# Altium schematic sheet EEPROM.SchDoc: EEPROM
size A4; ApprovedBy: LD Stanton; Author: LD Stanton; CompanyName: University of Cape Town; DrawnBy: Lawrence Stanton; Engineer: Lawrence Stanton; Organization: University of Cape Town; Address1: Department of Electrical Engineering; Address2: Rondebosch; Address3: Cape Town; Address4: South Africa 7701; DocumentNumber: 12; SheetNumber: 12; SheetTotal: 20
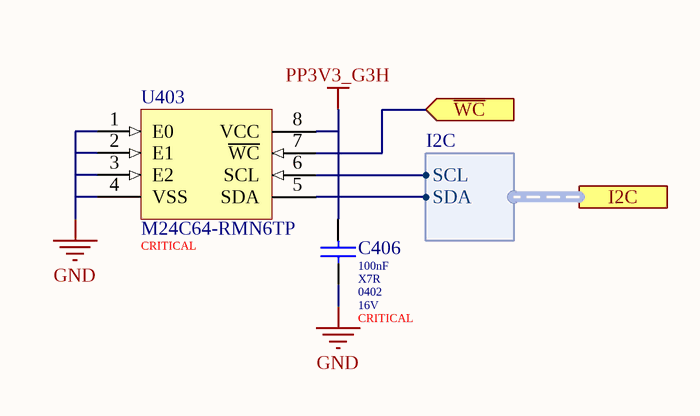
[diagram p0: EEPROM.SchDoc]

## Parts
C406  value 100nF  Dielectric: X7R  Package: 0402  Voltage: 16V  Populate: CRITICAL  [0402_050_5 (Samsumg) B]  (hidden comment: CL05B104KO5NNNC)
U403  M24C64-RMN6TP  Placement: CRITICAL  [SO8N (M24) B]

## Ports
I2C (harness I2C), ~{WC} (in)

## Harnesses
I2C: SCL, SDA

## Nets
GND: C406.2 U403.1(E0) U403.2(E1) U403.3(E2) U403.4(VSS)
PP3V3_G3H: C406.1 U403.8(VCC)
~{WC}: U403.7(~{WC}) ; port ~{WC}
NetU403_5: U403.5(SDA) ; port I2C.SDA
NetU403_6: U403.6(SCL) ; port I2C.SCL

## Notes on the sheet
- Size:
- Date:
- A4
- Number:
- Time:
- Revision:
- Sheet
- of
- File:
- Author:

## Library data of the parts
C406 = CMP-045-000014-12: MLCC 100nF 0402 16V X7R ±10%; Manufacturer: Samsung; ComponentLink1Description: Datasheet; ComponentLink1URL: https://datasheet.lcsc.com/szlcsc/Samsung-Electro-Mechanics-CL05C100JB5NNNC_C32949.pdf; LCSC Part Number: C1525; Tolerance: ±10%
U403 = CMP-001-0001-4: IC EEPROM 64KBIT 1MHZ 8TSSOP; Manufacturer: STMicroelectronics; Manufacturer Part Number: M24512-RDW6TP; Ibis Model: M24C32; Nominal Supply Current: 3mA; Min Supply Voltage: 1.8V; Interface: I2C; Max Frequency: 400kHz; Density: 64Kb; Operating Supply Voltage: 5V; Max Supply Voltage: 5.5V; Access Time: 900ns; Component Type: Standard; Mount: Surface Mount; Number of Pins: 8; ComponentLink2Description: Product Page; ComponentLink1URL: https://www.st.com/resource/en/datasheet/m24c64-r.pdf; LCSC Part Number: C79988; Lead Free: Lead Free; Radiation Hardening: No; RoHS: Yes; Case/Package: SOIC; ComponentLink1Description: Datasheet; ComponentLink2URL: https://www.st.com/en/memories/m24c64-r.html; Package Quantity: 2500; Pricing 2: 1=0,32900, 10=0,32900, 25=0,32900, 50=0,32900, 100=0,30200, 250=0,30200, 500=0,30200, 1000=0,30200 (USD); Category: EEPROM; Pin Count: 8; Stock 2: 540; Memory Type: EEPROM; Memory Size: 64Kb; Max Operating Temperature: 85°C; Packaging: Tape and Reel; Min Operating Temperature: -40°C; Design Item ID: M24512-RMN6TP; Source: M24.SchLib